# EAGLE schematic EEZ DIB MIO168 r1B1 (EAGLE 7.2.0)
Assembly variants: Farnell, TME

## Sheet 1 of 6: DIB interface
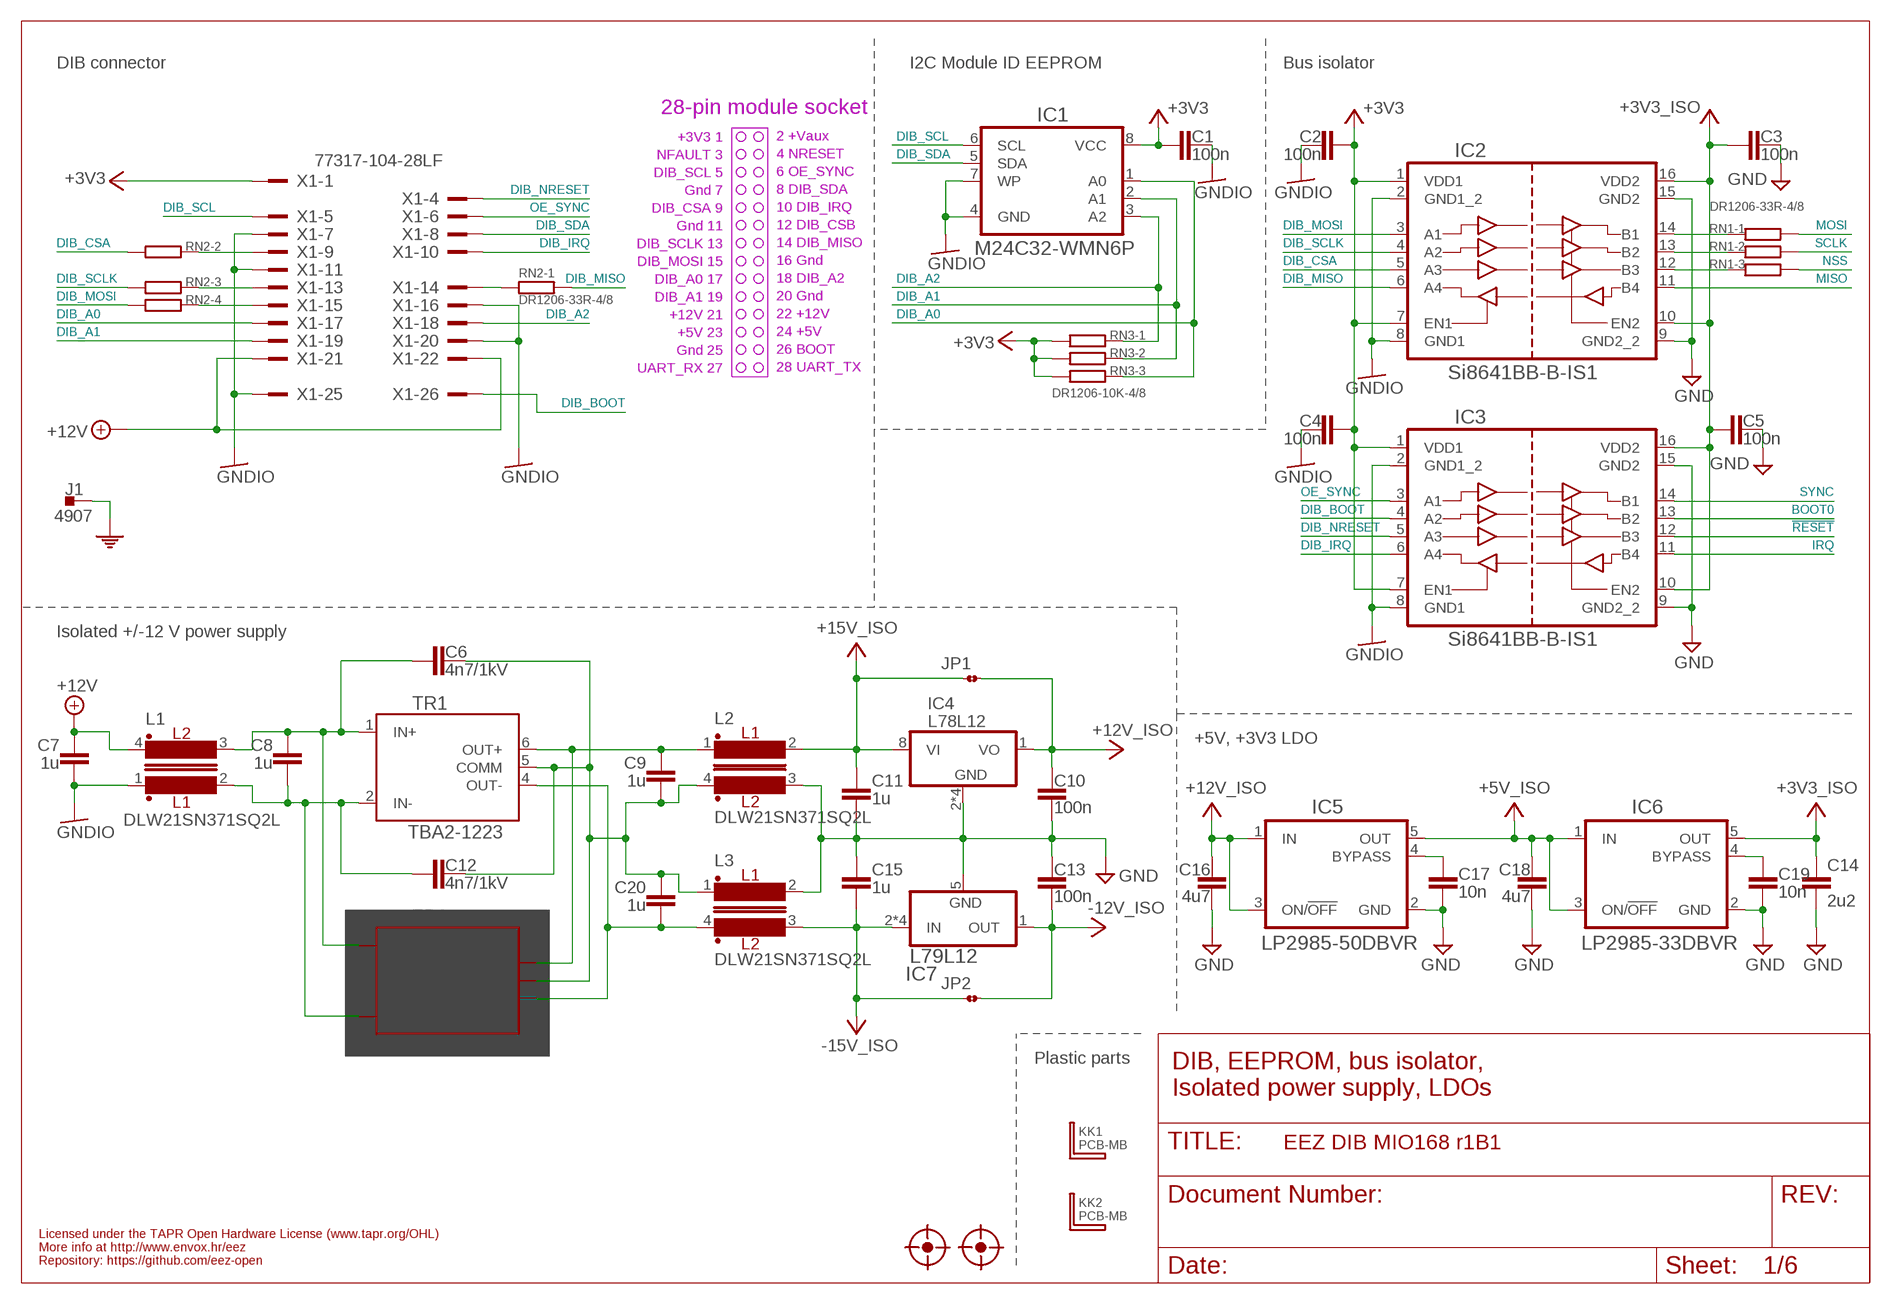
[diagram p0: schematic, sheet 1]

### Parts
C1  100n  C-EUC0603  [C0603]
C2  100n  C-EUC0603  [C0603]
C3  100n  C-EUC0603  [C0603]
C4  100n  C-EUC0603  [C0603]
C5  100n  C-EUC0603  [C0603]
C6  4n7/1kV  C-EUC1812  [C1812]
C7  1u  C-EUC0805  [C0805]
C8  1u  C-EUC0805  [C0805]
C9  1u  C-EUC0805  [C0805]
C10  100n  C-EUC0603  [C0603]
C11  1u  C-EUC0805  [C0805]
C12  4n7/1kV  C-EUC1812  [C1812]
C13  100n  C-EUC0603  [C0603]
C14  2u2  C-EUC0805  [C0805]
C15  1u  C-EUC0805  [C0805]
C16  4u7  C-EUC0805  [C0805]
C17  10n  C-EUC0805  [C0805]
C18  4u7  C-EUC0805  [C0805]
C19  10n  C-EUC0805  [C0805]
C20  1u  C-EUC0805  [C0805]
FM1  FIDUCIAL_2  [FIDUCIAL_DUAL]
FM2  FIDUCIAL_2  [FIDUCIAL_DUAL]
IC1  M24C32-WMN6P  AT24CXXSOIC8  [SOIC127P600X173-8N]
IC2  Si8641BB-B-IS1  SI8641NSOIC-16  [SOIC-16]
IC3  Si8641BB-B-IS1  SI8641NSOIC-16  [SOIC-16]
IC4  L78L12  MC78LXXSOIC8  [SOIC127P600X173-8N]
IC5  LP2985-50DBVR  LP2985  [SOT95P270X145-5N]
IC6  LP2985-33DBVR  LP2985  [SOT95P270X145-5N]
IC7  L79L12  MC79LXXSOIC  [SOIC127P600X173-8N]
J1  4907  PCB_TAB-4907  [PCB_TAB-4907]
JP1  JP2-CUT-0805  [R_0805]
JP2  JP2-CUT-0805  [R_0805]
KK1  PCB-MB  [PCB-MB]
KK2  PCB-MB  [PCB-MB]
L1  DLW21SN371SQ2L  DLW21S  [MURATA_DLW21S]
L2  DLW21SN371SQ2L  DLW21S  [MURATA_DLW21S]
L3  DLW21SN371SQ2L  DLW21S  [MURATA_DLW21S]
RN1  DR1206-33R-4/8  R_ARRAY4  [CAY16]
RN2  DR1206-33R-4/8  R_ARRAY4  [CAY16]
RN3  DR1206-10K-4/8  R_ARRAY4  [CAY16]
TR1  TBA2-1223  TBA-DUAL-2W  [TBA2]
TR2  MDD02M-15  MDD02  [MDD02]
X1  77317-104-28LF  [77317-104-28LF]

### Nets
!RESET: IC3.12(B3) ; also sheet 2,4,6
+3V3: C1.2 C2.1 C4.1 IC1.8(VCC) IC2.1(VDD1) IC2.7(EN1) IC3.1(VDD1) IC3.7(EN1) RN3.6 RN3.7 RN3.8 X1.1
+3V3_ISO: C3.2 C5.2 C14.1 IC2.10(EN2) IC2.16(VDD2) IC3.10(EN2) IC3.16(VDD2) IC6.5(OUT) ; also sheet 2,3,4,5,6
+5V_ISO: C18.2 IC5.5(OUT) IC6.1(IN) IC6.3(ON/!OFF) ; also sheet 4,6
+12V: C7.2 L1.4 X1.21 X1.22
+12V_ISO: C10.1 C16.2 IC4.1(VO) IC5.1(IN) IC5.3(ON/!OFF) JP1.2 ; also sheet 3,4
+15V_ISO: C11.2 IC4.8(VI) JP1.1 L2.2 ; also sheet 6
-12V_ISO: C13.2 IC7.1(OUT) JP2.2 ; also sheet 3,4,6
-15V_ISO: C15.1 IC7.2(IN) IC7.3(IN) IC7.6(IN) IC7.7(IN) JP2.1 L3.3 ; also sheet 6
BOOT0: IC3.13(B2) ; also sheet 2
DIB_A0: IC1.1(A0) RN3.3 X1.17
DIB_A1: IC1.2(A1) RN3.2 X1.19
DIB_A2: IC1.3(A2) RN3.1 X1.18
DIB_BOOT: IC3.4(A2) X1.26
DIB_CSA: IC2.5(A3) RN2.2
DIB_IRQ: IC3.6(A4) X1.10
DIB_MISO: IC2.6(A4) RN2.1
DIB_MOSI: IC2.3(A1) RN2.4
DIB_NRESET: IC3.5(A3) X1.4
DIB_SCL: IC1.6(SCL) X1.5
DIB_SCLK: IC2.4(A2) RN2.3
DIB_SDA: IC1.5(SDA) X1.8
GND: C3.1 C5.1 C10.2 C11.1 C13.1 C14.2 C15.2 C16.1 C17.1 C18.1 C19.1 IC2.9(GND2_2) IC2.15(GND2) IC3.9(GND2_2) IC3.15(GND2) IC4.2(GND) IC4.3(GND) IC4.6(GND) IC4.7(GND) IC5.2(GND) IC6.2(GND) IC7.5(GND) L2.3 L3.2 ; also sheet 2,3,4,5,6
GNDIO: C1.1 C2.2 C4.2 C7.1 IC1.4(GND) IC1.7(WP) IC2.2(GND1_2) IC2.8(GND1) IC3.2(GND1_2) IC3.8(GND1) L1.1 X1.7 X1.11 X1.16 X1.20 X1.25
IRQ: IC3.11(B4) ; also sheet 2
MISO: IC2.11(B4) ; also sheet 2
MOSI: RN1.8 ; also sheet 2
N$12: IC2.14(B1) RN1.1
N$47: C9.2 L2.1 TR1.6(OUT+) TR2.7(OUT+)
N$48: C6.2 C9.1 C12.2 C20.2 L2.4 L3.1 TR1.5(COMM) TR2.6(COMM)
N$49: C20.1 L3.4 TR1.4(OUT-) TR2.5(OUT-)
N$52: C6.1 C8.2 L1.3 TR1.1(IN+) TR2.1(IN+)
N$53: C8.1 C12.1 L1.2 TR1.2(IN-) TR2.2(IN-)
N$69: RN2.7 X1.9
N$70: C17.2 IC5.4(BYPASS)
N$99: RN2.6 X1.13
N$101: RN2.8 X1.14
N$102: RN2.5 X1.15
N$106: C19.2 IC6.4(BYPASS)
N$116: IC2.13(B2) RN1.2
N$118: IC2.12(B3) RN1.3
NSS: RN1.6 ; also sheet 2
OE_SYNC: IC3.3(A1) X1.6
PE: J1.1 J1.2 ; also sheet 6
SCLK: RN1.7 ; also sheet 2
SYNC: IC3.14(B1) ; also sheet 2
Unconnected: RN1.4 RN1.5 RN3.4 RN3.5 X1.2 X1.3 X1.12 X1.23 X1.24 X1.27 X1.28

### Notes on the sheet
- DIB connector | I2C Module ID EEPROM | Bus isolator
- 28-pin module socket
- +3V3 1
- 2 +Vaux
- NFAULT 3
- 4 NRESET
- DIB_SCL 5
- 6 OE_SYNC
- Gnd 7
- 8 DIB_SDA
- DIB_CSA 9
- 10 DIB_IRQ
- Gnd 11
- 12 DIB_CSB
- DIB_SCLK 13
- 14 DIB_MISO
- DIB_MOSI 15
- 16 Gnd
- DIB_A0 17
- 18 DIB_A2
- DIB_A1 19
- 20 Gnd
- +12V 21
- 22 +12V
- +5V 23
- 24 +5V
- Gnd 25
- 26 BOOT
- UART_RX 27
- 28 UART_TX
- Isolated +/-12 V power supply
- +5V, +3V3 LDO
- Plastic parts
- DIB, EEPROM, bus isolator,
  Isolated power supply, LDOs
- Licensed under the TAPR Open Hardware License (www.tapr.org/OHL)
- More info at http://www.envox.hr/eez
- Repository: https://github.com/eez-open

## Sheet 2 of 6
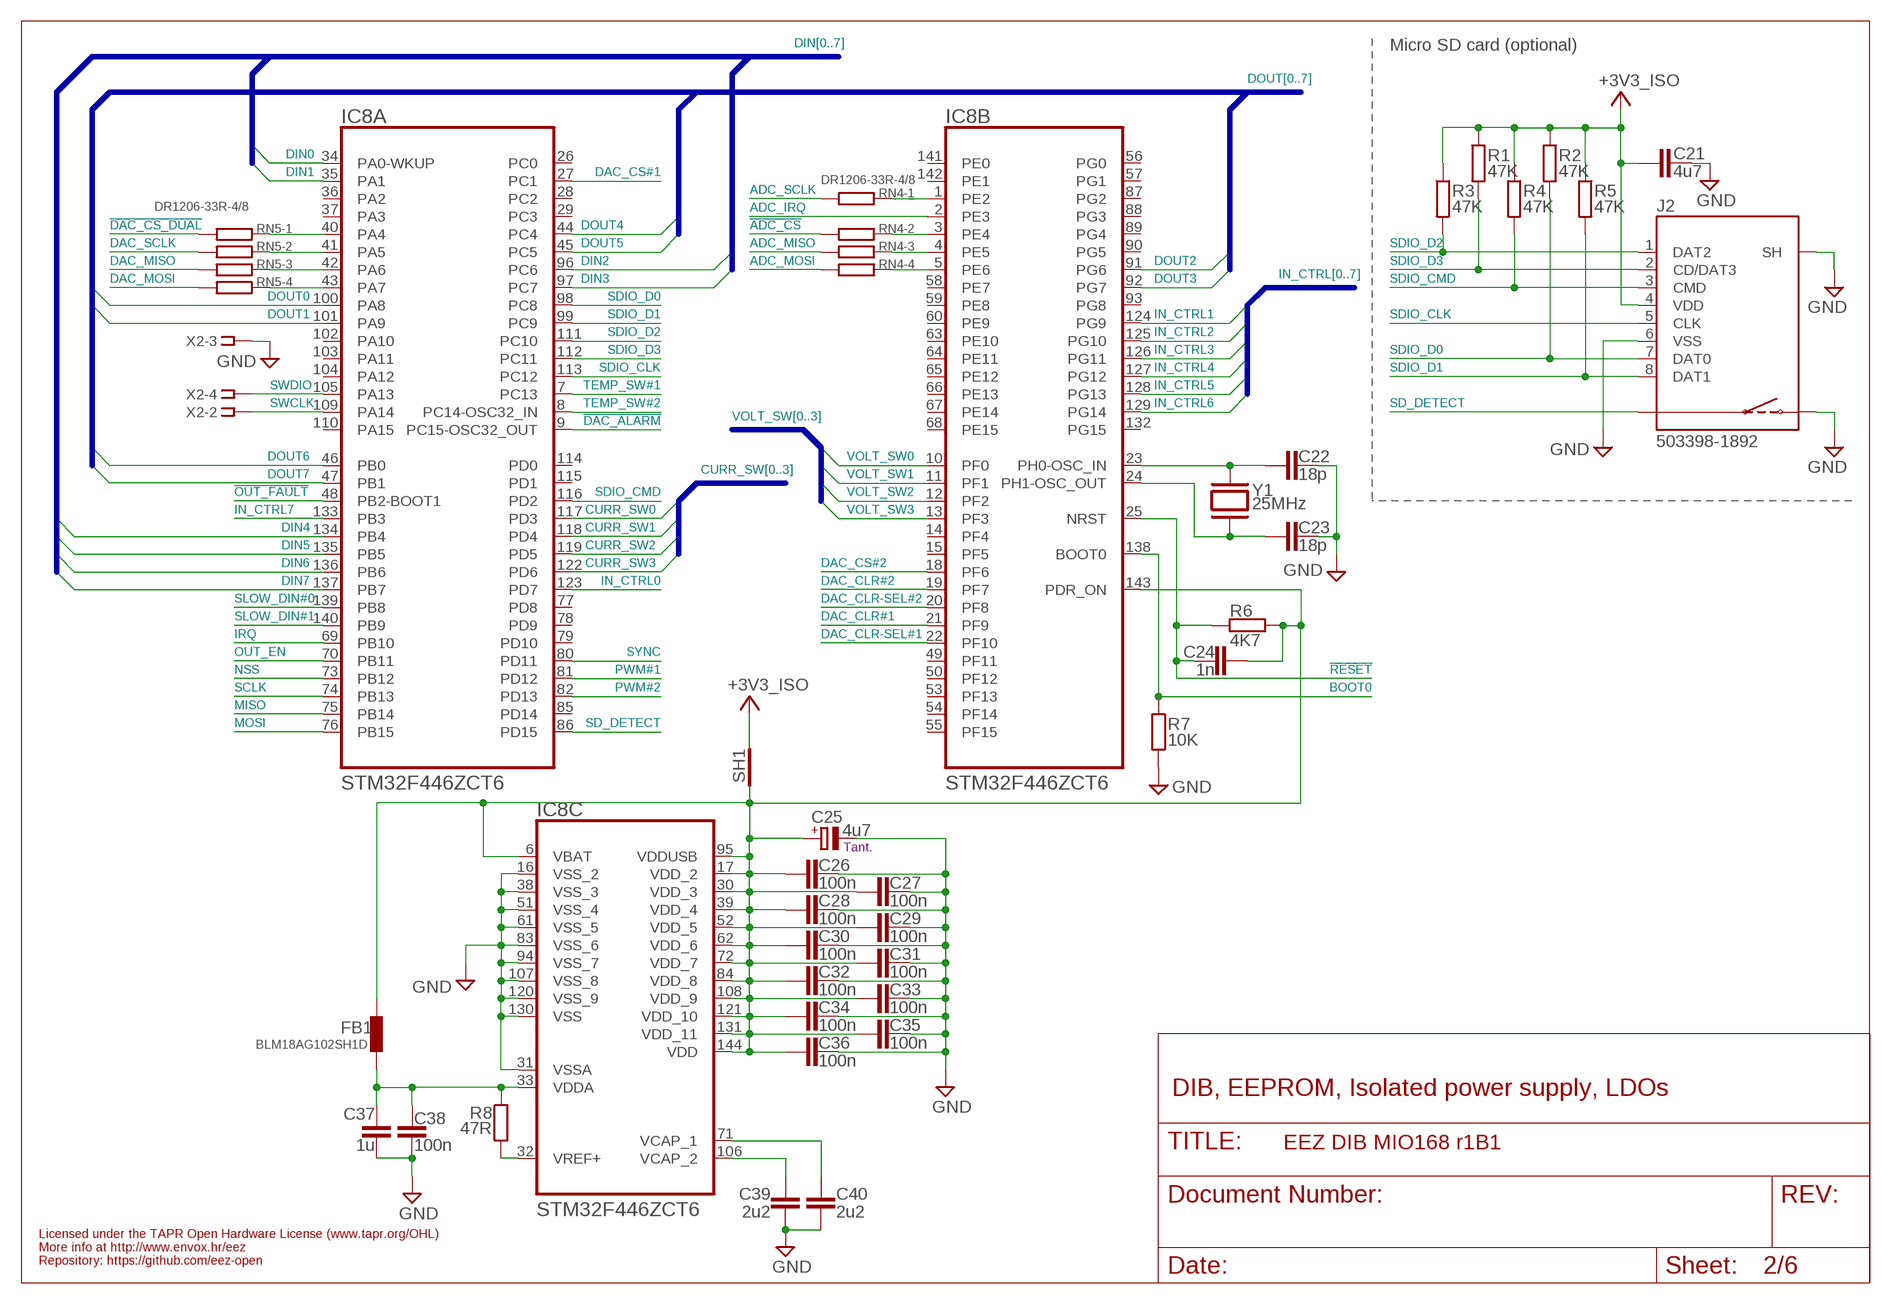
[diagram p1: schematic, sheet 2]

### Parts
C21  4u7  C-EUC0805  [C0805]
C22  18p  C-EUC0603  [C0603]
C23  18p  C-EUC0603  [C0603]
C24  1n  C-EUC0805  [C0805]
C25  4u7  ECAP1206  [EC1206]
C26  100n  C-EUC0603  [C0603]
C27  100n  C-EUC0603  [C0603]
C28  100n  C-EUC0603  [C0603]
C29  100n  C-EUC0603  [C0603]
C30  100n  C-EUC0603  [C0603]
C31  100n  C-EUC0603  [C0603]
C32  100n  C-EUC0603  [C0603]
C33  100n  C-EUC0603  [C0603]
C34  100n  C-EUC0603  [C0603]
C35  100n  C-EUC0603  [C0603]
C36  100n  C-EUC0603  [C0603]
C37  1u  C-EUC0805  [C0805]
C38  100n  C-EUC0603  [C0603]
C39  2u2  C-EUC0805  [C0805]
C40  2u2  C-EUC0805  [C0805]
FB1  BLM18AG102SH1D  FERRITE_BEAD0603  [BEAD0603]
IC8  STM32F446ZCT6  [LQFP-144]
J2  503398-1892  5033981892  [5033981892]
R1  47K  R-EU_R0805  [R0805]
R2  47K  R-EU_R0805  [R0805]
R3  47K  R-EU_R0805  [R0805]
R4  47K  R-EU_R0805  [R0805]
R5  47K  R-EU_R0805  [R0805]
R6  4K7  R-EU_R0805  [R0805]
R7  10K  R-EU_R0805  [R0805]
R8  47R  R-EU_R0805  [R0805]
RN4  DR1206-33R-4/8  R_ARRAY4  [CAY16]
RN5  DR1206-33R-4/8  R_ARRAY4  [CAY16]
SH1  SHORTNOHOLE  [SHORT_NOHOLE]
X2  SSW-106-02-S-S  [SSW-106-02-S-S]
Y1  25MHz  XTALSMD  [HC-49/4H]

### Nets
!ADC_CS: RN4.2 ; also sheet 6
!DAC_ALARM: IC8.9(A:PC15-OSC32_OUT) ; also sheet 3
!DAC_CS_DUAL: RN5.1 ; also sheet 4
!OUT_FAULT: IC8.48(A:PB2-BOOT1) ; also sheet 4
!RESET: C24.1 IC8.25(B:NRST) R6.2 ; also sheet 1,4,6
+3V3_ISO: C21.1 J2.4(VDD) R1.1 R2.1 R3.1 R4.1 R5.1 SH1.2(GND_B) ; also sheet 1,3,4,5,6
+3V3_MCU: C24.2 C25.+ C26.1 C27.1 C28.1 C29.1 C30.1 C31.1 C32.1 C33.1 C34.1 C35.1 C36.1 FB1.P$1 IC8.6(C:VBAT) IC8.17(C:VDD_2) IC8.30(C:VDD_3) IC8.39(C:VDD_4) IC8.52(C:VDD_5) IC8.62(C:VDD_6) IC8.72(C:VDD_7) IC8.84(C:VDD_8) IC8.95(C:VDDUSB) IC8.108(C:VDD_9) IC8.121(C:VDD_10) IC8.131(C:VDD_11) IC8.143(B:PDR_ON) IC8.144(C:VDD) R6.1 SH1.1(GND_A)
ADC_IRQ: IC8.2(B:PE3) ; also sheet 6
ADC_MISO: RN4.3 ; also sheet 6
ADC_MOSI: RN4.4 ; also sheet 6
ADC_SCLK: RN4.1 ; also sheet 6
BOOT0: IC8.138(B:BOOT0) R7.2 ; also sheet 1
CURR_SW0: IC8.117(A:PD3) ; also sheet 6
CURR_SW1: IC8.118(A:PD4) ; also sheet 6
CURR_SW2: IC8.119(A:PD5) ; also sheet 6
CURR_SW3: IC8.122(A:PD6) ; also sheet 6
DAC_CLR#1: IC8.21(B:PF9) ; also sheet 3
DAC_CLR#2: IC8.19(B:PF7) ; also sheet 3
DAC_CLR-SEL#1: IC8.22(B:PF10) ; also sheet 3
DAC_CLR-SEL#2: IC8.20(B:PF8) ; also sheet 3
DAC_CS#1: IC8.27(A:PC1) ; also sheet 3
DAC_CS#2: IC8.18(B:PF6) ; also sheet 3
DAC_MISO: RN5.3 ; also sheet 3
DAC_MOSI: RN5.4 ; also sheet 3,4
DAC_SCLK: RN5.2 ; also sheet 3,4
DIN0: IC8.34(A:PA0-WKUP) ; also sheet 5
DIN1: IC8.35(A:PA1) ; also sheet 5
DIN2: IC8.96(A:PC6) ; also sheet 5
DIN3: IC8.97(A:PC7) ; also sheet 5
DIN4: IC8.134(A:PB4) ; also sheet 5
DIN5: IC8.135(A:PB5) ; also sheet 5
DIN6: IC8.136(A:PB6) ; also sheet 5
DIN7: IC8.137(A:PB7) ; also sheet 5
DOUT0: IC8.100(A:PA8) ; also sheet 4
DOUT1: IC8.101(A:PA9) ; also sheet 4
DOUT2: IC8.91(B:PG6) ; also sheet 4
DOUT3: IC8.92(B:PG7) ; also sheet 4
DOUT4: IC8.44(A:PC4) ; also sheet 4
DOUT5: IC8.45(A:PC5) ; also sheet 4
DOUT6: IC8.46(A:PB0) ; also sheet 4
DOUT7: IC8.47(A:PB1) ; also sheet 4
GND: C21.2 C22.1 C23.1 C25.- C26.2 C27.2 C28.2 C29.2 C30.2 C31.2 C32.2 C33.2 C34.2 C35.2 C36.2 C37.2 C38.2 C39.1 C40.1 IC8.16(C:VSS_2) IC8.31(C:VSSA) IC8.38(C:VSS_3) IC8.51(C:VSS_4) IC8.61(C:VSS_5) IC8.83(C:VSS_6) IC8.94(C:VSS_7) IC8.107(C:VSS_8) IC8.120(C:VSS_9) IC8.130(C:VSS) J2.6(VSS) J2.S1(SH) J2.S2(SH) J2.S(SH) J2.SW2 R7.1 X2.3 ; also sheet 1,3,4,5,6
IN_CTRL0: IC8.123(A:PD7) ; also sheet 5
IN_CTRL1: IC8.124(B:PG9) ; also sheet 5
IN_CTRL2: IC8.125(B:PG10) ; also sheet 5
IN_CTRL3: IC8.126(B:PG11) ; also sheet 5
IN_CTRL4: IC8.127(B:PG12) ; also sheet 5
IN_CTRL5: IC8.128(B:PG13) ; also sheet 5
IN_CTRL6: IC8.129(B:PG14) ; also sheet 5
IN_CTRL7: IC8.133(A:PB3) ; also sheet 5
IRQ: IC8.69(A:PB10) ; also sheet 1
MISO: IC8.75(A:PB14) ; also sheet 1
MOSI: IC8.76(A:PB15) ; also sheet 1
N$11: IC8.40(A:PA4) RN5.8
N$29: IC8.41(A:PA5) RN5.7
N$34: IC8.42(A:PA6) RN5.6
N$37: IC8.43(A:PA7) RN5.5
N$39: IC8.1(B:PE2) RN4.8
N$40: IC8.3(B:PE4) RN4.7
N$41: IC8.4(B:PE5) RN4.6
N$44: IC8.5(B:PE6) RN4.5
N$97: C39.2 IC8.106(C:VCAP_2)
N$113: C40.2 IC8.71(C:VCAP_1)
N$115: C37.1 C38.1 FB1.P$2 IC8.33(C:VDDA) R8.1
N$121: IC8.32(C:VREF+) R8.2
NSS: IC8.73(A:PB12) ; also sheet 1
OUT_EN: IC8.70(A:PB11) ; also sheet 4
PWM#1: IC8.81(A:PD12) ; also sheet 4
PWM#2: IC8.82(A:PD13) ; also sheet 4
RCC_OSC_IN: C22.2 IC8.23(B:PH0-OSC_IN) Y1.2
RCC_OSC_OUT: C23.2 IC8.24(B:PH1-OSC_OUT) Y1.1
SCLK: IC8.74(A:PB13) ; also sheet 1
SD_DETECT: IC8.86(A:PD15) J2.SW1
SDIO_CLK: IC8.113(A:PC12) J2.5(CLK)
SDIO_CMD: IC8.116(A:PD2) J2.3(CMD) R4.2
SDIO_D0: IC8.98(A:PC8) J2.7(DAT0) R2.2
SDIO_D1: IC8.99(A:PC9) J2.8(DAT1) R5.2
SDIO_D2: IC8.111(A:PC10) J2.1(DAT2) R3.2
SDIO_D3: IC8.112(A:PC11) J2.2(CD/DAT3) R1.2
SLOW_DIN#0: IC8.139(A:PB8) ; also sheet 5
SLOW_DIN#1: IC8.140(A:PB9) ; also sheet 5
SWCLK: IC8.109(A:PA14) X2.2
SWDIO: IC8.105(A:PA13) X2.4
SYNC: IC8.80(A:PD11) ; also sheet 1
TEMP_SW#1: IC8.7(A:PC13) ; also sheet 6
TEMP_SW#2: IC8.8(A:PC14-OSC32_IN) ; also sheet 6
VOLT_SW0: IC8.10(B:PF0) ; also sheet 6
VOLT_SW1: IC8.11(B:PF1) ; also sheet 6
VOLT_SW2: IC8.12(B:PF2) ; also sheet 6
VOLT_SW3: IC8.13(B:PF3) ; also sheet 6
Unconnected: IC8.14(B:PF4) IC8.15(B:PF5) IC8.26(A:PC0) IC8.28(A:PC2) IC8.29(A:PC3) IC8.36(A:PA2) IC8.37(A:PA3) IC8.49(B:PF11) IC8.50(B:PF12) IC8.53(B:PF13) IC8.54(B:PF14) IC8.55(B:PF15) IC8.56(B:PG0) IC8.57(B:PG1) IC8.58(B:PE7) IC8.59(B:PE8) IC8.60(B:PE9) IC8.63(B:PE10) IC8.64(B:PE11) IC8.65(B:PE12) IC8.66(B:PE13) IC8.67(B:PE14) IC8.68(B:PE15) IC8.77(A:PD8) IC8.78(A:PD9) IC8.79(A:PD10) IC8.85(A:PD14) IC8.87(B:PG2) IC8.88(B:PG3) IC8.89(B:PG4) IC8.90(B:PG5) IC8.93(B:PG8) IC8.102(A:PA10) IC8.103(A:PA11) IC8.104(A:PA12) IC8.110(A:PA15) IC8.114(A:PD0) IC8.115(A:PD1) IC8.132(B:PG15) IC8.141(B:PE0) IC8.142(B:PE1) X2.1 X2.5 X2.6

### Buses
CURR_SW[0..3]
IN_CTRL[0..7]
DIN[0..7]
DOUT[0..7]
VOLT_SW[0..3]

### Notes on the sheet
- Micro SD card (optional)
- Tant.
- DIB, EEPROM, Isolated power supply, LDOs
- Licensed under the TAPR Open Hardware License (www.tapr.org/OHL)
- More info at http://www.envox.hr/eez
- Repository: https://github.com/eez-open

## Sheet 3 of 6: Voltage/current DACs
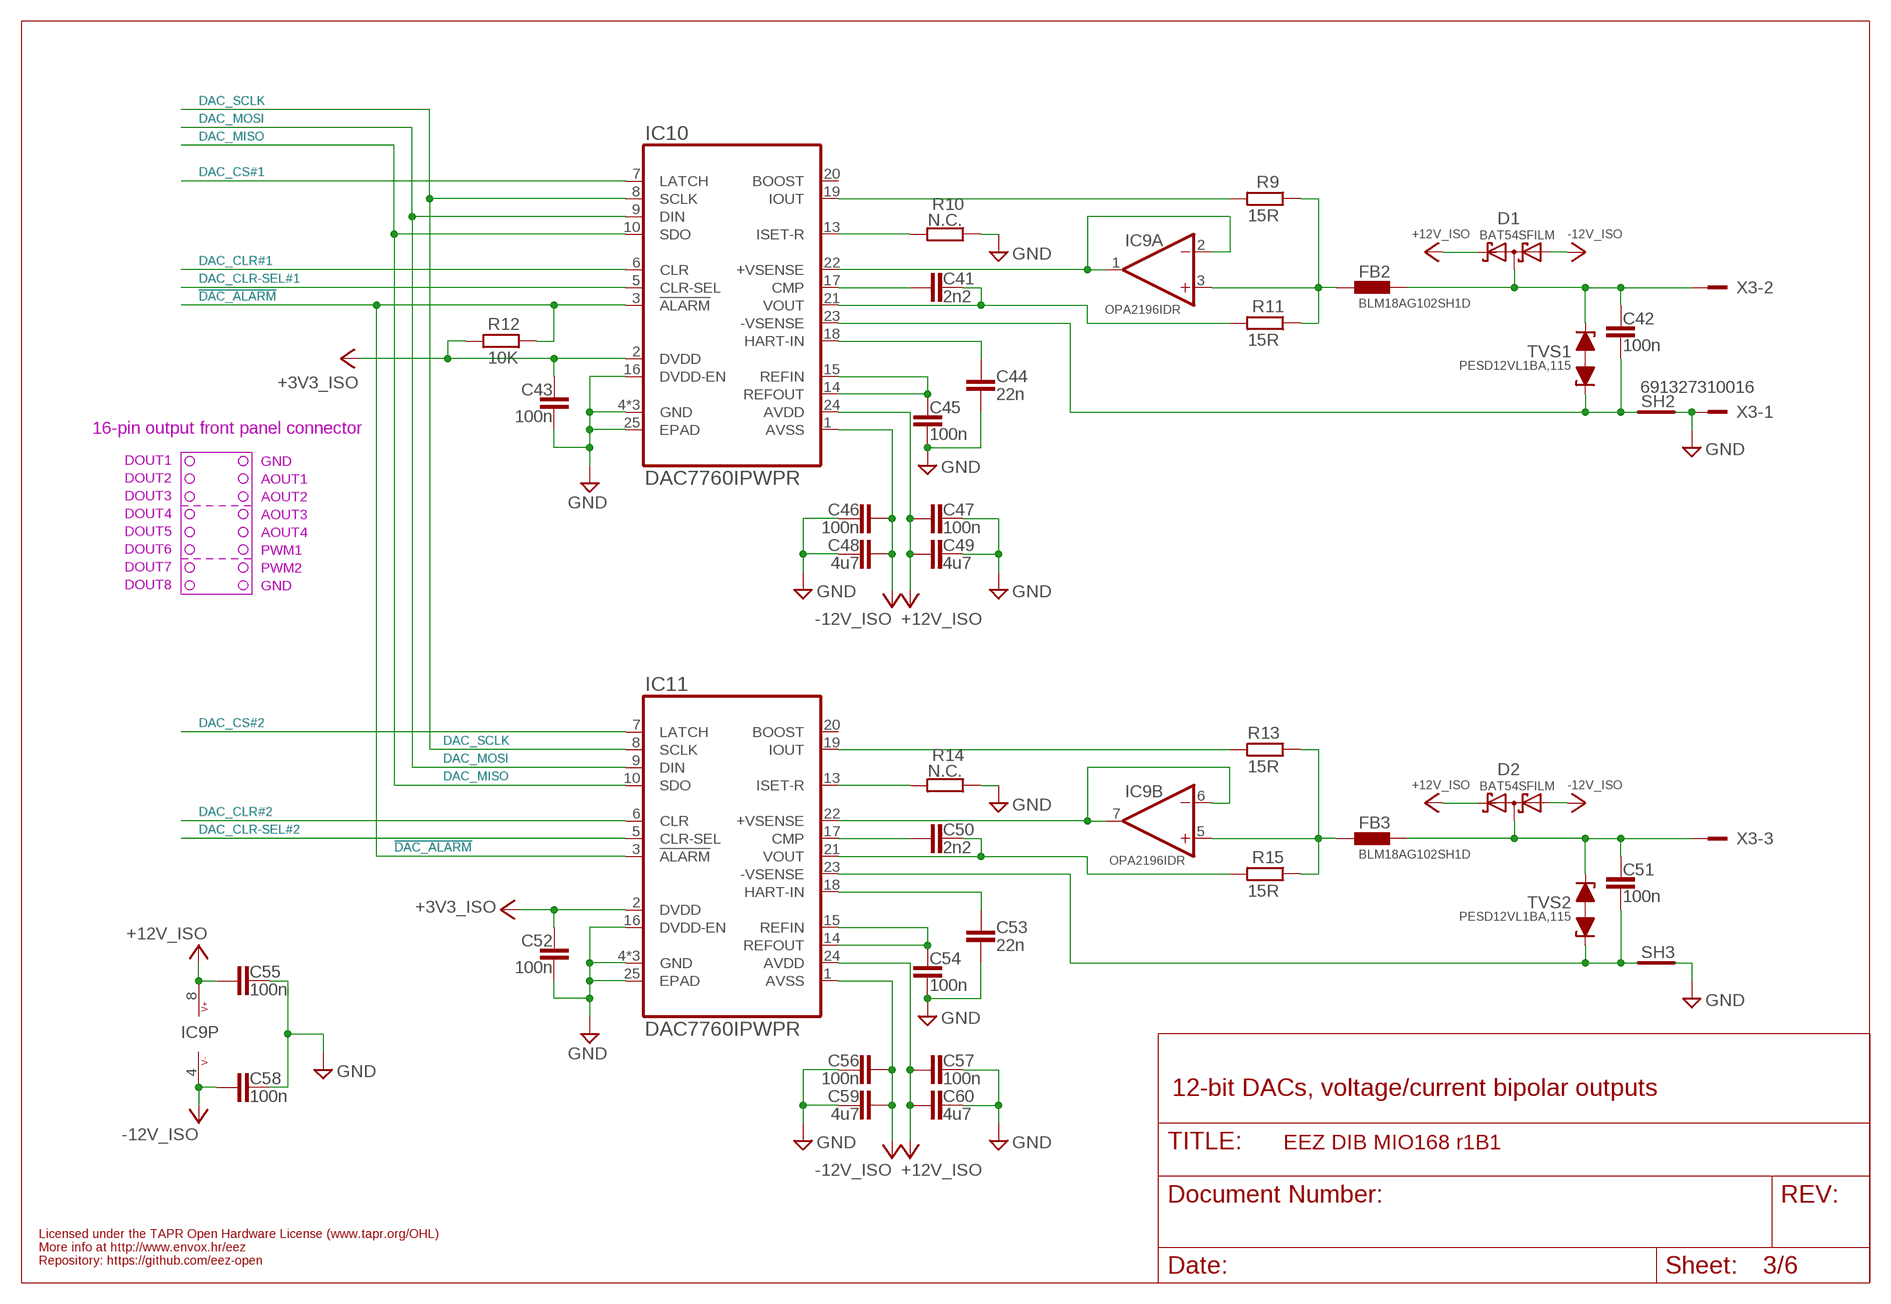
[diagram p2: schematic, sheet 3]

### Parts
C41  2n2  C-EUC0805  [C0805]
C42  100n  C-EUC0603  [C0603]
C43  100n  C-EUC0603  [C0603]
C44  22n  C-EUC0805  [C0805]
C45  100n  C-EUC0603  [C0603]
C46  100n  C-EUC0603  [C0603]
C47  100n  C-EUC0603  [C0603]
C48  4u7  C-EUC0805  [C0805]
C49  4u7  C-EUC0805  [C0805]
C50  2n2  C-EUC0805  [C0805]
C51  100n  C-EUC0603  [C0603]
C52  100n  C-EUC0603  [C0603]
C53  22n  C-EUC0805  [C0805]
C54  100n  C-EUC0603  [C0603]
C55  100n  C-EUC0603  [C0603]
C56  100n  C-EUC0603  [C0603]
C57  100n  C-EUC0603  [C0603]
C58  100n  C-EUC0603  [C0603]
C59  4u7  C-EUC0805  [C0805]
C60  4u7  C-EUC0805  [C0805]
D1  BAT54SFILM  BAT54S  [SOT23]
D2  BAT54SFILM  BAT54S  [SOT23]
FB2  BLM18AG102SH1D  FERRITE_BEAD0603  [BEAD0603]
FB3  BLM18AG102SH1D  FERRITE_BEAD0603  [BEAD0603]
IC9  OPA2196IDR  TL072SOIC8  [SOIC127P600X173-8N]
IC10  DAC7760IPWPR  [PWP24]
IC11  DAC7760IPWPR  [PWP24]
R9  15R  R-EU_R0805  [R0805]
R10  N.C.  R-EU_R0805  [R0805]
R11  15R  R-EU_R0805  [R0805]
R12  10K  R-EU_R0805  [R0805]
R13  15R  R-EU_R0805  [R0805]
R14  N.C.  R-EU_R0805  [R0805]
R15  15R  R-EU_R0805  [R0805]
SH2  SHORTNOHOLE  [SHORT_NOHOLE]
SH3  SHORTNOHOLE  [SHORT_NOHOLE]
TVS1  PESD12VL1BA,115  PESDXL1BA  [SOD323-BIDIR]
TVS2  PESD12VL1BA,115  PESDXL1BA  [SOD323-BIDIR]
X3  691327310016  [691327310016]

### Nets
!DAC_ALARM: IC10.3(!ALARM) IC11.3(!ALARM) R12.2 ; also sheet 2
+3V3_ISO: C43.1 C52.1 IC10.2(DVDD) IC11.2(DVDD) R12.1 ; also sheet 1,2,4,5,6
+12V_ISO: C47.1 C49.2 C55.1 C57.1 C60.2 D1.2(C2) D2.2(C2) IC9.8(P:V+) IC10.24(AVDD) IC11.24(AVDD) ; also sheet 1,4
-12V_ISO: C46.1 C48.2 C56.1 C58.1 C59.2 D1.1(A1) D2.1(A1) IC9.4(P:V-) IC10.1(AVSS) IC11.1(AVSS) ; also sheet 1,4,6
DAC_CLR#1: IC10.6(CLR) ; also sheet 2
DAC_CLR#2: IC11.6(CLR) ; also sheet 2
DAC_CLR-SEL#1: IC10.5(CLR-SEL) ; also sheet 2
DAC_CLR-SEL#2: IC11.5(CLR-SEL) ; also sheet 2
DAC_CS#1: IC10.7(LATCH) ; also sheet 2
DAC_CS#2: IC11.7(LATCH) ; also sheet 2
DAC_MISO: IC10.10(SDO) IC11.10(SDO) ; also sheet 2
DAC_MOSI: IC10.9(DIN) IC11.9(DIN) ; also sheet 2,4
DAC_OUT#1: C42.1 D1.3(C1A2) FB2.P$2 TVS1.C2 X3.2
DAC_OUT#2: C51.1 D2.3(C1A2) FB3.P$2 TVS2.C2 X3.3
DAC_SCLK: IC10.8(SCLK) IC11.8(SCLK) ; also sheet 2,4
GND: C43.2 C44.1 C45.2 C46.2 C47.2 C48.1 C49.1 C52.2 C53.1 C54.2 C55.2 C56.2 C57.2 C58.2 C59.1 C60.1 IC10.4(GND) IC10.11(GND) IC10.12(GND) IC10.16(DVDD-EN) IC10.25(EPAD) IC11.4(GND) IC11.11(GND) IC11.12(GND) IC11.16(DVDD-EN) IC11.25(EPAD) R10.1 R14.1 SH2.1(GND_A) SH3.1(GND_A) X3.1 ; also sheet 1,2,4,5,6
HART#1: C44.2 IC10.18(HART-IN)
HART#2: C53.2 IC11.18(HART-IN)
N$19: C50.2 IC11.17(CMP)
N$26: C50.1 IC11.21(VOUT) R15.2
N$27: IC9.6(B:-IN) IC9.7(B:OUT) IC11.22(+VSENSE)
N$43: FB3.P$1 IC9.5(B:+IN) R13.1 R15.1
N$45: IC11.19(IOUT) R13.2
N$46: C54.1 IC11.14(REFOUT) IC11.15(REFIN)
N$62: C41.2 IC10.17(CMP)
N$63: IC9.1(A:OUT) IC9.2(A:-IN) IC10.22(+VSENSE)
N$64: C51.2 IC11.23(-VSENSE) SH3.2(GND_B) TVS2.C1
N$65: FB2.P$1 IC9.3(A:+IN) R9.1 R11.1
N$66: C45.1 IC10.14(REFOUT) IC10.15(REFIN)
N$68: IC11.13(ISET-R) R14.2
N$79: C42.2 IC10.23(-VSENSE) SH2.2(GND_B) TVS1.C1
N$80: IC10.13(ISET-R) R10.2
N$82: C41.1 IC10.21(VOUT) R11.2
N$83: IC10.19(IOUT) R9.2
Unconnected: IC10.20(BOOST) IC11.20(BOOST)

### Notes on the sheet
- 16-pin output front panel connector
- GND
- DOUT1
- AOUT1
- DOUT2
- AOUT2
- DOUT3
- AOUT3
- DOUT4
- AOUT4
- DOUT5
- PWM1
- DOUT6
- PWM2
- DOUT7
- GND
- DOUT8
- 12-bit DACs, voltage/current bipolar outputs
- Licensed under the TAPR Open Hardware License (www.tapr.org/OHL)
- More info at http://www.envox.hr/eez
- Repository: https://github.com/eez-open

## Sheet 4 of 6: Voltage DAC, Digital outputs
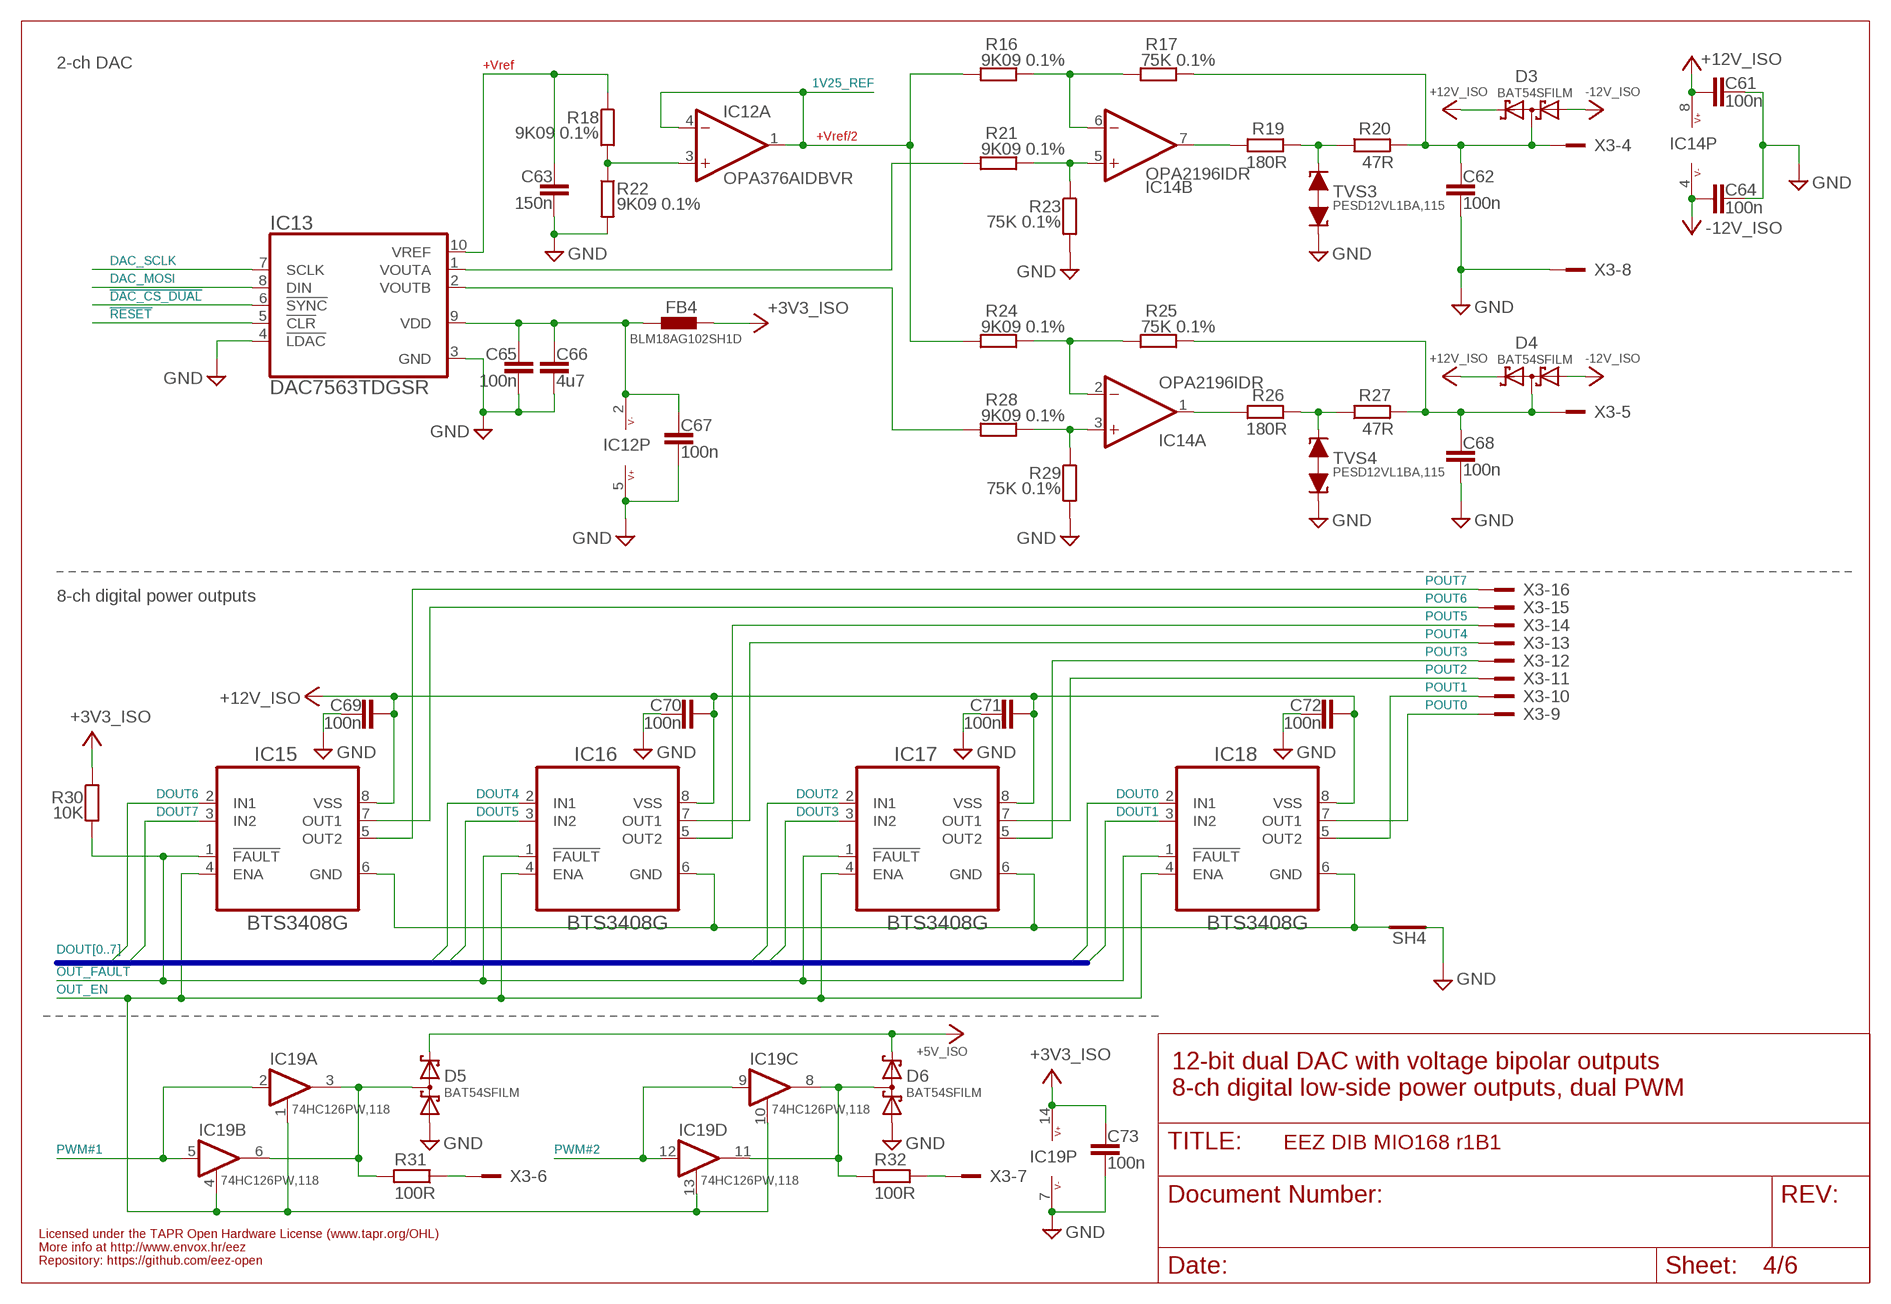
[diagram p3: schematic, sheet 4]

### Parts
C61  100n  C-EUC0603  [C0603]
C62  100n  C-EUC0603  [C0603]
C63  150n  C-EUC0805  [C0805]
C64  100n  C-EUC0603  [C0603]
C65  100n  C-EUC0603  [C0603]
C66  4u7  C-EUC0805  [C0805]
C67  100n  C-EUC0603  [C0603]
C68  100n  C-EUC0603  [C0603]
C69  100n  C-EUC0603  [C0603]
C70  100n  C-EUC0603  [C0603]
C71  100n  C-EUC0603  [C0603]
C72  100n  C-EUC0603  [C0603]
C73  100n  C-EUC0603  [C0603]
D3  BAT54SFILM  BAT54S  [SOT23]
D4  BAT54SFILM  BAT54S  [SOT23]
D5  BAT54SFILM  BAT54S  [SOT23]
D6  BAT54SFILM  BAT54S  [SOT23]
FB4  BLM18AG102SH1D  FERRITE_BEAD0603  [BEAD0603]
IC12  OPA376AIDBVR  [DBV5]
IC13  DAC7563TDGSR  [DGS10]
IC14  OPA2196IDR  TL072SOIC8  [SOIC127P600X173-8N]
IC15  BTS3408G  [SOIC127P600X173-8N]
IC16  BTS3408G  [SOIC127P600X173-8N]
IC17  BTS3408G  [SOIC127P600X173-8N]
IC18  BTS3408G  [SOIC127P600X173-8N]
IC19  74HC126PW,118  [PW14]
R16  9K09 0.1%  R-EU_R0805  [R0805]
R17  75K 0.1%  R-EU_R0805  [R0805]
R18  9K09 0.1%  R-EU_R0805  [R0805]
R19  180R  R-EU_R0805  [R0805]
R20  47R  R-EU_R0805  [R0805]
R21  9K09 0.1%  R-EU_R0805  [R0805]
R22  9K09 0.1%  R-EU_R0805  [R0805]
R23  75K 0.1%  R-EU_R0805  [R0805]
R24  9K09 0.1%  R-EU_R0805  [R0805]
R25  75K 0.1%  R-EU_R0805  [R0805]
R26  180R  R-EU_R0805  [R0805]
R27  47R  R-EU_R0805  [R0805]
R28  9K09 0.1%  R-EU_R0805  [R0805]
R29  75K 0.1%  R-EU_R0805  [R0805]
R30  10K  R-EU_R0805  [R0805]
R31  100R  R-EU_R0805  [R0805]
R32  100R  R-EU_R0805  [R0805]
SH4  SHORTNOHOLE  [SHORT_NOHOLE]
TVS3  PESD12VL1BA,115  PESDXL1BA  [SOD323-BIDIR]
TVS4  PESD12VL1BA,115  PESDXL1BA  [SOD323-BIDIR]

### Nets
1V25_REF: IC12.1(A:OUT) IC12.4(A:-IN) R16.2 R24.2 ; also sheet 6
2V5_REF: C63.2 IC13.10(VREF) R18.1
!DAC_CS_DUAL: IC13.6(!SYNC) ; also sheet 2
!OUT_FAULT: IC15.1(!FAULT) IC16.1(!FAULT) IC17.1(!FAULT) IC18.1(!FAULT) R30.2 ; also sheet 2
!RESET: IC13.5(!CLR) ; also sheet 1,2,6
+3V3_ISO: C73.2 FB4.P$2 IC19.14(P:V+) R30.1 ; also sheet 1,2,3,5,6
+5V_ISO: D5.2(C2) D6.2(C2) ; also sheet 1,6
+12V_ISO: C61.1 C69.2 C70.2 C71.2 C72.2 D3.2(C2) D4.2(C2) IC14.8(P:V+) IC15.8(VSS) IC16.8(VSS) IC17.8(VSS) IC18.8(VSS) ; also sheet 1,3
-12V_ISO: C64.1 D3.1(A1) D4.1(A1) IC14.4(P:V-) ; also sheet 1,3,6
DAC_MOSI: IC13.8(DIN) ; also sheet 2,3
DAC_SCLK: IC13.7(SCLK) ; also sheet 2,3
DOUT0: IC18.2(IN1) ; also sheet 2
DOUT1: IC18.3(IN2) ; also sheet 2
DOUT2: IC17.2(IN1) ; also sheet 2
DOUT3: IC17.3(IN2) ; also sheet 2
DOUT4: IC16.2(IN1) ; also sheet 2
DOUT5: IC16.3(IN2) ; also sheet 2
DOUT6: IC15.2(IN1) ; also sheet 2
DOUT7: IC15.3(IN2) ; also sheet 2
GND: C61.2 C62.2 C63.1 C64.2 C65.2 C66.1 C67.2 C68.2 C69.1 C70.1 C71.1 C72.1 C73.1 D5.1(A1) D6.1(A1) IC12.5(P:V+) IC13.3(GND) IC13.4(!LDAC) IC19.7(P:V-) R22.2 R23.2 R29.2 SH4.1(GND_A) TVS3.C1 TVS4.C1 X3.8 ; also sheet 1,2,3,5,6
ISET1: R19.2 R20.1 TVS3.C2
ISET2: R26.2 R27.1 TVS4.C2
N$1: IC15.6(GND) IC16.6(GND) IC17.6(GND) IC18.6(GND) SH4.2(GND_B)
N$22: R31.1 X3.6
N$25: R32.1 X3.7
N$54: IC14.5(B:+IN) R21.1 R23.1
N$55: IC14.6(B:-IN) R16.1 R17.2
N$56: IC14.7(B:OUT) R19.1
N$57: IC14.3(A:+IN) R28.1 R29.1
N$58: IC14.2(A:-IN) R24.1 R25.2
N$59: IC14.1(A:OUT) R26.1
N$60: IC12.3(A:+IN) R18.2 R22.1
N$61: IC13.1(VOUTA) R21.2
N$67: IC13.2(VOUTB) R28.2
N$71: C65.1 C66.2 C67.1 FB4.P$1 IC12.2(P:V-) IC13.9(VDD)
N$73: C68.1 D4.3(C1A2) R25.1 R27.2 X3.5
N$74: C62.1 D3.3(C1A2) R17.1 R20.2 X3.4
N$129: D5.3(C1A2) IC19.3(A:O) IC19.6(B:O) R31.2
N$134: D6.3(C1A2) IC19.8(C:O) IC19.11(D:O) R32.2
OUT_EN: IC15.4(ENA) IC16.4(ENA) IC17.4(ENA) IC18.4(ENA) IC19.1(A:EN) IC19.4(B:EN) IC19.10(C:EN) IC19.13(D:EN) ; also sheet 2
POUT0: IC18.7(OUT1) X3.9
POUT1: IC18.5(OUT2) X3.10
POUT2: IC17.7(OUT1) X3.11
POUT3: IC17.5(OUT2) X3.12
POUT4: IC16.7(OUT1) X3.13
POUT5: IC16.5(OUT2) X3.14
POUT6: IC15.7(OUT1) X3.15
POUT7: IC15.5(OUT2) X3.16
PWM#1: IC19.2(A:I) IC19.5(B:I) ; also sheet 2
PWM#2: IC19.9(C:I) IC19.12(D:I) ; also sheet 2

### Buses
DOUT[0..7]

### Notes on the sheet
- 2-ch DAC
- +Vref
- +Vref/2
- 8-ch digital power outputs
- 12-bit dual DAC with voltage bipolar outputs
  8-ch digital low-side power outputs, dual PWM
- Licensed under the TAPR Open Hardware License (www.tapr.org/OHL)
- More info at http://www.envox.hr/eez
- Repository: https://github.com/eez-open

## Sheet 5 of 6: Digital inputs
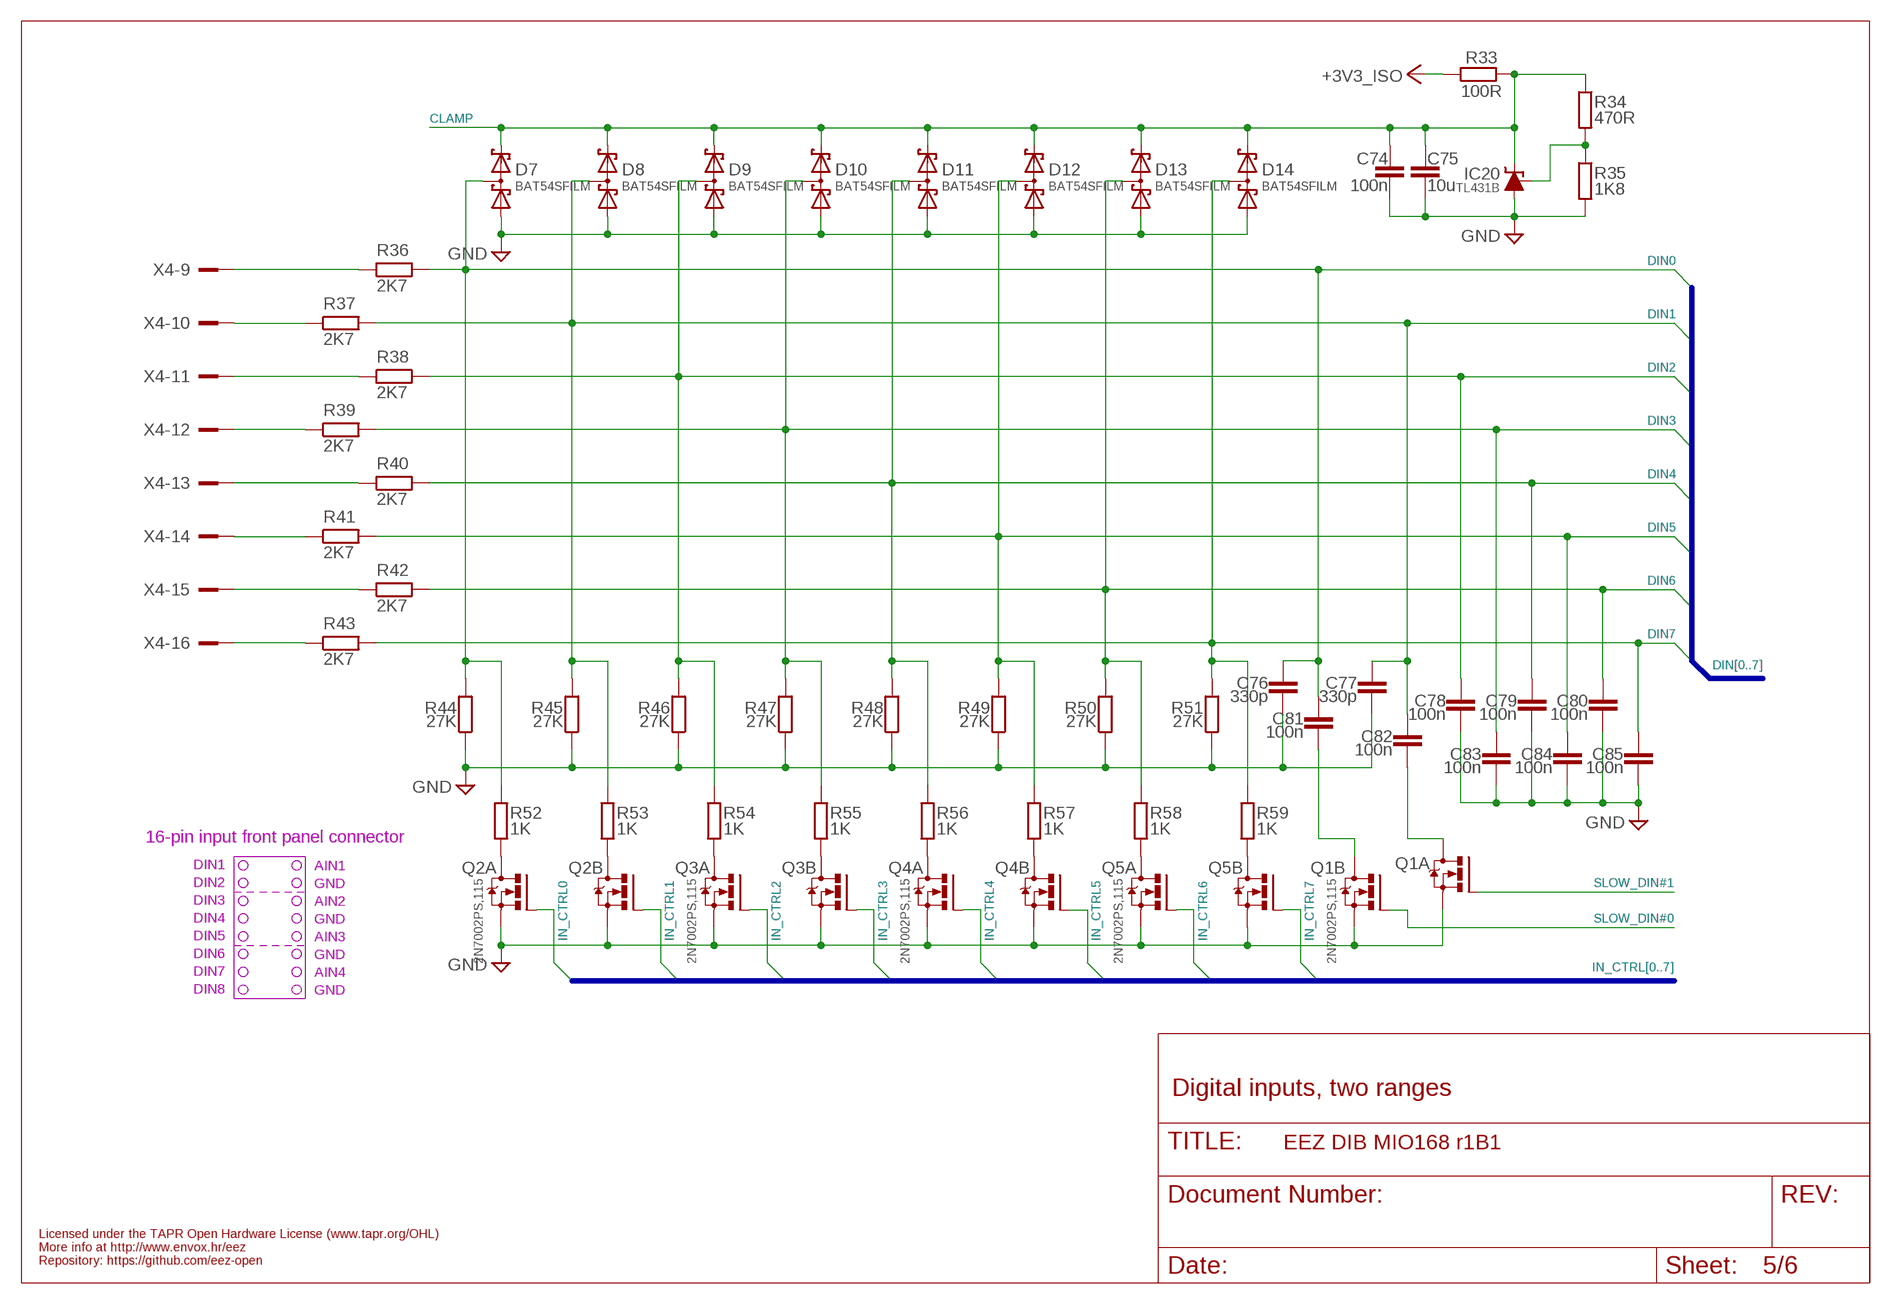
[diagram p4: schematic, sheet 5]

### Parts
C74  100n  C-EUC0603  [C0603]
C75  10u  C-EUC1206  [C1206]
C76  330p  C-EUC0805  [C0805]
C77  330p  C-EUC0805  [C0805]
C78  100n  C-EUC0603  [C0603]
C79  100n  C-EUC0603  [C0603]
C80  100n  C-EUC0603  [C0603]
C81  100n  C-EUC0603  [C0603]
C82  100n  C-EUC0603  [C0603]
C83  100n  C-EUC0603  [C0603]
C84  100n  C-EUC0603  [C0603]
C85  100n  C-EUC0603  [C0603]
D7  BAT54SFILM  BAT54S  [SOT23]
D8  BAT54SFILM  BAT54S  [SOT23]
D9  BAT54SFILM  BAT54S  [SOT23]
D10  BAT54SFILM  BAT54S  [SOT23]
D11  BAT54SFILM  BAT54S  [SOT23]
D12  BAT54SFILM  BAT54S  [SOT23]
D13  BAT54SFILM  BAT54S  [SOT23]
D14  BAT54SFILM  BAT54S  [SOT23]
IC20  TL431B  TL431  [SOT103P240X110-3N]
Q1  2N7002PS,115  [SC88]
Q2  2N7002PS,115  [SC88]
Q3  2N7002PS,115  [SC88]
Q4  2N7002PS,115  [SC88]
Q5  2N7002PS,115  [SC88]
R33  100R  R-EU_R0805  [R0805]
R34  470R  R-EU_R0805  [R0805]
R35  1K8  R-EU_R0805  [R0805]
R36  2K7  R-EU_R1206  [R1206]
R37  2K7  R-EU_R1206  [R1206]
R38  2K7  R-EU_R1206  [R1206]
R39  2K7  R-EU_R1206  [R1206]
R40  2K7  R-EU_R1206  [R1206]
R41  2K7  R-EU_R1206  [R1206]
R42  2K7  R-EU_R1206  [R1206]
R43  2K7  R-EU_R1206  [R1206]
R44  27K  R-EU_R0805  [R0805]
R45  27K  R-EU_R0805  [R0805]
R46  27K  R-EU_R0805  [R0805]
R47  27K  R-EU_R0805  [R0805]
R48  27K  R-EU_R0805  [R0805]
R49  27K  R-EU_R0805  [R0805]
R50  27K  R-EU_R0805  [R0805]
R51  27K  R-EU_R0805  [R0805]
R52  1K  R-EU_R0805  [R0805]
R53  1K  R-EU_R0805  [R0805]
R54  1K  R-EU_R0805  [R0805]
R55  1K  R-EU_R0805  [R0805]
R56  1K  R-EU_R0805  [R0805]
R57  1K  R-EU_R0805  [R0805]
R58  1K  R-EU_R0805  [R0805]
R59  1K  R-EU_R0805  [R0805]
X4  691327310016  [691327310016]

### Nets
+3V3_ISO: R33.1 ; also sheet 1,2,3,4,6
CLAMP: C74.1 C75.1 D7.2(C2) D8.2(C2) D9.2(C2) D10.2(C2) D11.2(C2) D12.2(C2) D13.2(C2) D14.2(C2) IC20.1(C) R33.2 R34.1
DIN0: C76.1 C81.1 D7.3(C1A2) R36.2 R44.2 R52.1 ; also sheet 2
DIN1: C77.1 C82.1 D8.3(C1A2) R37.2 R45.2 R53.1 ; also sheet 2
DIN2: C78.1 D9.3(C1A2) R38.2 R46.2 R54.1 ; also sheet 2
DIN3: C83.1 D10.3(C1A2) R39.2 R47.2 R55.1 ; also sheet 2
DIN4: C79.1 D11.3(C1A2) R40.2 R48.2 R56.1 ; also sheet 2
DIN5: C84.1 D12.3(C1A2) R41.2 R49.2 R57.1 ; also sheet 2
DIN6: C80.1 D13.3(C1A2) R42.2 R50.2 R58.1 ; also sheet 2
DIN7: C85.1 D14.3(C1A2) R43.2 R51.2 R59.1 ; also sheet 2
GND: C74.2 C75.2 C76.2 C77.2 C78.2 C79.2 C80.2 C83.2 C84.2 C85.2 D7.1(A1) D8.1(A1) D9.1(A1) D10.1(A1) D11.1(A1) D12.1(A1) D13.1(A1) D14.1(A1) IC20.3(A) Q1.1(A:S) Q1.4(B:S) Q2.1(A:S) Q2.4(B:S) Q3.1(A:S) Q3.4(B:S) Q4.1(A:S) Q4.4(B:S) Q5.1(A:S) Q5.4(B:S) R35.2 R44.1 R45.1 R46.1 R47.1 R48.1 R49.1 R50.1 R51.1 ; also sheet 1,2,3,4,6
IN_CTRL0: Q2.2(A:G) ; also sheet 2
IN_CTRL1: Q2.5(B:G) ; also sheet 2
IN_CTRL2: Q3.2(A:G) ; also sheet 2
IN_CTRL3: Q3.5(B:G) ; also sheet 2
IN_CTRL4: Q4.2(A:G) ; also sheet 2
IN_CTRL5: Q4.5(B:G) ; also sheet 2
IN_CTRL6: Q5.2(A:G) ; also sheet 2
IN_CTRL7: Q5.5(B:G) ; also sheet 2
N$7: IC20.2(R) R34.2 R35.1
N$8: Q2.6(A:D) R52.2
N$9: Q2.3(B:D) R53.2
N$10: Q3.6(A:D) R54.2
N$13: Q3.3(B:D) R55.2
N$14: R37.1 X4.10
N$15: Q4.6(A:D) R56.2
N$16: Q4.3(B:D) R57.2
N$17: Q5.6(A:D) R58.2
N$23: Q5.3(B:D) R59.2
N$24: C81.2 Q1.3(B:D)
N$36: R36.1 X4.9
N$38: R38.1 X4.11
N$42: R39.1 X4.12
N$76: C82.2 Q1.6(A:D)
N$109: R40.1 X4.13
N$119: R42.1 X4.15
N$120: R43.1 X4.16
N$122: R41.1 X4.14
SLOW_DIN#0: Q1.5(B:G) ; also sheet 2
SLOW_DIN#1: Q1.2(A:G) ; also sheet 2

### Buses
DIN[0..7]
IN_CTRL[0..7]

### Notes on the sheet
- 16-pin input front panel connector
- AIN1
- DIN1
- GND
- DIN2
- AIN2
- DIN3
- GND
- DIN4
- AIN3
- DIN5
- GND
- DIN6
- AIN4
- DIN7
- GND
- DIN8
- Digital inputs, two ranges
- Licensed under the TAPR Open Hardware License (www.tapr.org/OHL)
- More info at http://www.envox.hr/eez
- Repository: https://github.com/eez-open

## Sheet 6 of 6: Voltage/current ADC
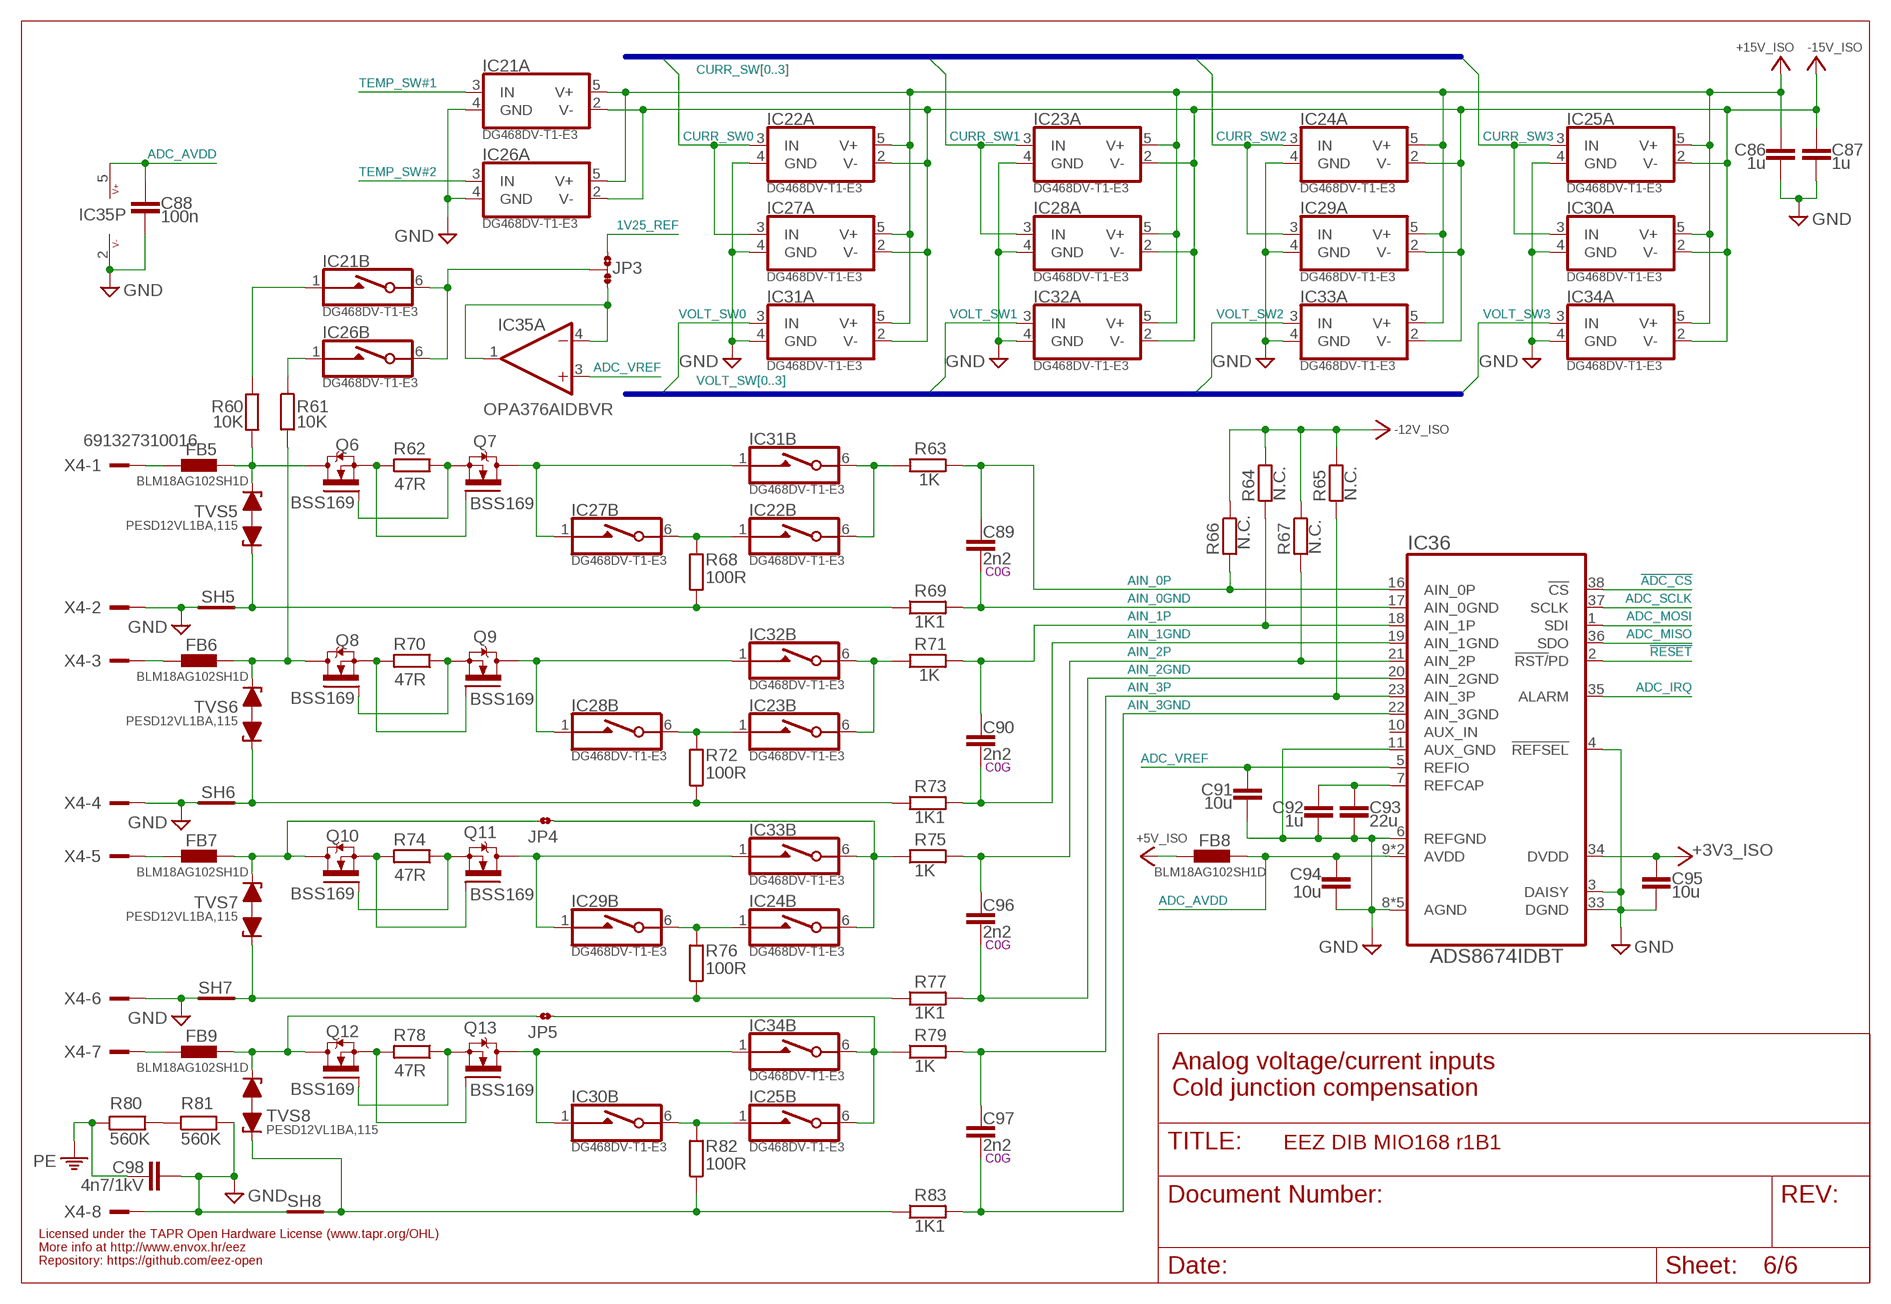
[diagram p5: schematic, sheet 6]

### Parts
C86  1u  C-EUC0805  [C0805]
C87  1u  C-EUC0805  [C0805]
C88  100n  C-EUC0603  [C0603]
C89  2n2  C-EUC0805  [C0805]
C90  2n2  C-EUC0805  [C0805]
C91  10u  C-EUC1206  [C1206]
C92  1u  C-EUC0805  [C0805]
C93  22u  C-EUC1206  [C1206]
C94  10u  C-EUC1206  [C1206]
C95  10u  C-EUC1206  [C1206]
C96  2n2  C-EUC0805  [C0805]
C97  2n2  C-EUC0805  [C0805]
C98  4n7/1kV  C-EUC1812  [C1812]
FB5  BLM18AG102SH1D  FERRITE_BEAD0603  [BEAD0603]
FB6  BLM18AG102SH1D  FERRITE_BEAD0603  [BEAD0603]
FB7  BLM18AG102SH1D  FERRITE_BEAD0603  [BEAD0603]
FB8  BLM18AG102SH1D  FERRITE_BEAD0603  [BEAD0603]
FB9  BLM18AG102SH1D  FERRITE_BEAD0603  [BEAD0603]
IC21  DG468DV-T1-E3  [DG6_TSOP6]
IC22  DG468DV-T1-E3  [DG6_TSOP6]
IC23  DG468DV-T1-E3  [DG6_TSOP6]
IC24  DG468DV-T1-E3  [DG6_TSOP6]
IC25  DG468DV-T1-E3  [DG6_TSOP6]
IC26  DG468DV-T1-E3  [DG6_TSOP6]
IC27  DG468DV-T1-E3  [DG6_TSOP6]
IC28  DG468DV-T1-E3  [DG6_TSOP6]
IC29  DG468DV-T1-E3  [DG6_TSOP6]
IC30  DG468DV-T1-E3  [DG6_TSOP6]
IC31  DG468DV-T1-E3  [DG6_TSOP6]
IC32  DG468DV-T1-E3  [DG6_TSOP6]
IC33  DG468DV-T1-E3  [DG6_TSOP6]
IC34  DG468DV-T1-E3  [DG6_TSOP6]
IC35  OPA376AIDBVR  [DBV5]
IC36  ADS8674IDBT  [DBT38]
JP3  JP3-CUT  [JP3-CUT]
JP4  JP2-CUT-0805  [R_0805]
JP5  JP2-CUT-0805  [R_0805]
Q6  BSS169  [SOT103P240X110-3N]
Q7  BSS169  [SOT103P240X110-3N]
Q8  BSS169  [SOT103P240X110-3N]
Q9  BSS169  [SOT103P240X110-3N]
Q10  BSS169  [SOT103P240X110-3N]
Q11  BSS169  [SOT103P240X110-3N]
Q12  BSS169  [SOT103P240X110-3N]
Q13  BSS169  [SOT103P240X110-3N]
R60  10K  R-EU_R0805  [R0805]
R61  10K  R-EU_R0805  [R0805]
R62  47R  R-EU_R0805  [R0805]
R63  1K  R-EU_R0805  [R0805]
R64  N.C.  R-EU_R0805  [R0805]
R65  N.C.  R-EU_R0805  [R0805]
R66  N.C.  R-EU_R0805  [R0805]
R67  N.C.  R-EU_R0805  [R0805]
R68  100R  R-EU_R0805  [R0805]
R69  1K1  R-EU_R0805  [R0805]
R70  47R  R-EU_R0805  [R0805]
R71  1K  R-EU_R0805  [R0805]
R72  100R  R-EU_R0805  [R0805]
R73  1K1  R-EU_R0805  [R0805]
R74  47R  R-EU_R0805  [R0805]
R75  1K  R-EU_R0805  [R0805]
R76  100R  R-EU_R0805  [R0805]
R77  1K1  R-EU_R0805  [R0805]
R78  47R  R-EU_R0805  [R0805]
R79  1K  R-EU_R0805  [R0805]
R80  560K  R-EU_R1206  [R1206]
R81  560K  R-EU_R1206  [R1206]
R82  100R  R-EU_R0805  [R0805]
R83  1K1  R-EU_R0805  [R0805]
SH5  SHORTNOHOLE  [SHORT_NOHOLE]
SH6  SHORTNOHOLE  [SHORT_NOHOLE]
SH7  SHORTNOHOLE  [SHORT_NOHOLE]
SH8  SHORTNOHOLE  [SHORT_NOHOLE]
TVS5  PESD12VL1BA,115  PESDXL1BA  [SOD323-BIDIR]
TVS6  PESD12VL1BA,115  PESDXL1BA  [SOD323-BIDIR]
TVS7  PESD12VL1BA,115  PESDXL1BA  [SOD323-BIDIR]
TVS8  PESD12VL1BA,115  PESDXL1BA  [SOD323-BIDIR]

### Nets
1V25_REF: JP3.NO ; also sheet 4
!ADC_CS: IC36.38(!CS) ; also sheet 2
!RESET: IC36.2(!RST/!PD) ; also sheet 1,2,4
+3V3_ISO: C95.2 IC36.34(DVDD) ; also sheet 1,2,3,4,5
+5V_ISO: FB8.P$1 ; also sheet 1,4
+15V_ISO: C86.1 IC21.5(A:V+) IC22.5(A:V+) IC23.5(A:V+) IC24.5(A:V+) IC25.5(A:V+) IC26.5(A:V+) IC27.5(A:V+) IC28.5(A:V+) IC29.5(A:V+) IC30.5(A:V+) IC31.5(A:V+) IC32.5(A:V+) IC33.5(A:V+) IC34.5(A:V+) ; also sheet 1
-12V_ISO: R64.1 R65.1 R66.1 R67.1 ; also sheet 1,3,4
-15V_ISO: C87.1 IC21.2(A:V-) IC22.2(A:V-) IC23.2(A:V-) IC24.2(A:V-) IC25.2(A:V-) IC26.2(A:V-) IC27.2(A:V-) IC28.2(A:V-) IC29.2(A:V-) IC30.2(A:V-) IC31.2(A:V-) IC32.2(A:V-) IC33.2(A:V-) IC34.2(A:V-) ; also sheet 1
ADC_AVDD: C88.1 C94.2 FB8.P$2 IC35.5(P:V+) IC36.9(AVDD) IC36.30(AVDD)
ADC_IRQ: IC36.35(ALARM) ; also sheet 2
ADC_MISO: IC36.36(SDO) ; also sheet 2
ADC_MOSI: IC36.1(SDI) ; also sheet 2
ADC_SCLK: IC36.37(SCLK) ; also sheet 2
ADC_VREF: C91.2 IC35.3(A:+IN) IC36.5(REFIO)
AGND2: R72.1 R73.1 SH6.2(GND_B) TVS6.C1
AGND4: R82.1 R83.1 SH8.2(GND_B) TVS8.C1
AIN0: FB5.P$2 Q6.3(D) R60.2 TVS5.C2
AIN1: FB6.P$2 Q8.3(D) R61.2 TVS6.C2
AIN_0GND: C89.1 IC36.17(AIN_0GND) R69.2
AIN_0P: C89.2 IC36.16(AIN_0P) R63.2 R66.2
AIN_1GND: C90.1 IC36.19(AIN_1GND) R73.2
AIN_1P: C90.2 IC36.18(AIN_1P) R64.2 R71.2
AIN_2GND: C96.1 IC36.20(AIN_2GND) R77.2
AIN_2P: C96.2 IC36.21(AIN_2P) R67.2 R75.2
AIN_3GND: C97.1 IC36.22(AIN_3GND) R83.2
AIN_3P: C97.2 IC36.23(AIN_3P) R65.2 R79.2
CURR_SW0: IC22.3(A:IN) IC27.3(A:IN) ; also sheet 2
CURR_SW1: IC23.3(A:IN) IC28.3(A:IN) ; also sheet 2
CURR_SW2: IC24.3(A:IN) IC29.3(A:IN) ; also sheet 2
CURR_SW3: IC25.3(A:IN) IC30.3(A:IN) ; also sheet 2
GND: C86.2 C87.2 C88.2 C91.1 C92.1 C93.1 C94.1 C95.1 C98.2 IC21.4(A:GND) IC22.4(A:GND) IC23.4(A:GND) IC24.4(A:GND) IC25.4(A:GND) IC26.4(A:GND) IC27.4(A:GND) IC28.4(A:GND) IC29.4(A:GND) IC30.4(A:GND) IC31.4(A:GND) IC32.4(A:GND) IC33.4(A:GND) IC34.4(A:GND) IC35.2(P:V-) IC36.3(DAISY) IC36.4(!REFSEL) IC36.6(REFGND) IC36.8(AGND) IC36.11(AUX_GND) IC36.28(AGND) IC36.29(AGND) IC36.31(AGND) IC36.32(AGND) IC36.33(DGND) R81.2 SH5.1(GND_A) SH6.1(GND_A) SH7.1(GND_A) SH8.1(GND_A) X4.2 X4.4 X4.6 X4.8 ; also sheet 1,2,3,4,5
N$2: Q12.1(G) Q13.2(S) R78.1
N$3: R68.1 R69.1 SH5.2(GND_B) TVS5.C1
N$4: Q12.2(S) Q13.1(G) R78.2
N$6: IC25.1(B:NO) IC30.6(B:COM) R82.2
N$20: IC21.6(B:COM) IC26.6(B:COM) JP3.COM
N$21: R80.2 R81.1
N$28: IC25.6(B:COM) IC34.6(B:COM) JP5.2 R79.1
N$30: IC30.1(B:NO) IC34.1(B:NO) Q13.3(D)
N$31: IC35.1(A:OUT) IC35.4(A:-IN) JP3.NC
N$32: Q8.1(G) Q9.2(S) R70.1
N$33: Q8.2(S) Q9.1(G) R70.2
N$35: C92.2 C93.2 IC36.7(REFCAP)
N$50: IC23.1(B:NO) IC28.6(B:COM) R72.2
N$51: IC23.6(B:COM) IC32.6(B:COM) R71.1
N$75: IC28.1(B:NO) IC32.1(B:NO) Q9.3(D)
N$77: Q10.1(G) Q11.2(S) R74.1
N$78: Q6.1(G) Q7.2(S) R62.1
N$84: Q10.2(S) Q11.1(G) R74.2
N$85: IC24.1(B:NO) IC29.6(B:COM) R76.2
N$86: Q6.2(S) Q7.1(G) R62.2
N$87: IC24.6(B:COM) IC33.6(B:COM) JP4.2 R75.1
N$88: IC29.1(B:NO) IC33.1(B:NO) Q11.3(D)
N$89: IC22.1(B:NO) IC27.6(B:COM) R68.2
N$90: R76.1 R77.1 SH7.2(GND_B) TVS7.C1
N$91: FB5.P$1 X4.1
N$92: IC22.6(B:COM) IC31.6(B:COM) R63.1
N$93: FB6.P$1 X4.3
N$94: FB7.P$1 X4.5
N$95: IC27.1(B:NO) IC31.1(B:NO) Q7.3(D)
N$96: FB9.P$1 X4.7
N$126: IC21.1(B:NO) R60.1
N$130: IC26.1(B:NO) R61.1
N$136: FB7.P$2 JP4.1 Q10.3(D) TVS7.C2
N$137: FB9.P$2 JP5.1 Q12.3(D) TVS8.C2
PE: C98.1 R80.1 ; also sheet 1
TEMP_SW#1: IC21.3(A:IN) ; also sheet 2
TEMP_SW#2: IC26.3(A:IN) ; also sheet 2
VOLT_SW0: IC31.3(A:IN) ; also sheet 2
VOLT_SW1: IC32.3(A:IN) ; also sheet 2
VOLT_SW2: IC33.3(A:IN) ; also sheet 2
VOLT_SW3: IC34.3(A:IN) ; also sheet 2
Unconnected: IC36.10(AUX_IN)

### Buses
CURR_SW[0..3]
VOLT_SW[0..3]

### Notes on the sheet
- C0G
- C0G
- C0G
- Analog voltage/current inputs
  Cold junction compensation
- C0G
- Licensed under the TAPR Open Hardware License (www.tapr.org/OHL)
- More info at http://www.envox.hr/eez
- Repository: https://github.com/eez-open

## Library data of the parts
C1-C24 C26-C98 = rcl:C-EU: CAPACITOR, European symbol
C25 = EEZ_Lib1:ECAP
D1-D14 = diode:BAT54S: Schottky Diodes Pin connection corrected 2011-05-04 Source: Fairchild .. BAT54.pdf
FB1-FB9 = EEZ_Lib1:FERRITE_BEAD: FAIR-RITE - 2506033007Y3 - FERRITE BEAD, 0.04OHM, 3A, 0603 Farnell: 2112873
FM1 FM2 = EEZ_Lib1:FIDUCIAL: Fiducial mark for pick and place automation
IC1 = EEZ_Lib1:AT24CXX: I2C-Compatible (2-wire) Serial EEPROM
IC2 IC3 = EEZ_Lib1:SI8641: Low power 4-ch digital isolator (3+1) Farnell: 2423288
IC4 = EEZ_Lib1:MC78LXX: μA78L00 series positive voltage regulators
IC5 IC6 = EEZ_DIB:LP2985: 150-mA Low-noise Low-dropout Regulator With Shutdown
IC7 = EEZ_Lib1:MC79LXX: 3-terminal negative voltage regulator, up to 100mA
IC8 = EEZ_DIB:STM32F446
IC9 IC14 = EEZ_Lib1:TL072
IC10 IC11 = EEZ_TI:DAC7760: Single-Channel, 12-Bit Programmable Current and Voltage Output DAC for 4-mA to 20-mA Current Loop Applications
IC12 IC35 = EEZ_TI:OPA376A: Low-Noise, Low Quiescent Current, Precision Operational Amplifier
IC13 = EEZ_TI:DAC7563: Dual 12-Bit, Low-Power, Buffered, Voltage-Output DAC With 2.5-V, 4-PPM/°C Internal Reference
IC15-IC18 = EEZ_Lib1:BTS3408G: Smart Dual Low-side Power Switch
IC19 = EEZ_DIB:74HC126: Quad buffer/line driver; 3-state
IC20 = EEZ_Lib1:TL431: Precision programmable reference
IC21-IC34 = EEZ_DIB:DG468: Low Power, High Voltage SPST Analog Switch
IC36 = EEZ_TI:ADS8674: 14-Bit, 500-kSPS, 4-Channel, Single-Supply, SAR ADCs with Bipolar Input Ranges
J1 = EEZ_connectors:PCB_TAB: PCB quick-fit terminal
J2 = EEZ_Lib1:5033981892: SD Micro connector; push-push; SMT; gold plated
JP1 JP2 JP4 JP5 = EEZ_Lib1:JP2-CUT
JP3 = EEZ_Lib1:JP3-CUT
KK1 KK2 = EEZ_Lib1:PCB-MB: Richo Mounting Block; 16 x 6 mm
L1-L3 = EEZ_inductors_and_transformers:DLW21S: Murata 0805 Common mode choke coil/Common mode noise filter
Q1-Q5 = EEZ_DIB:2N7002PS: Dual 60 V, 320 mA N-channel Trench MOSFET
Q6-Q13 = EEZ_Lib1:BSS169: SIPMOS® Small-Signal-Transistor depletion mode
R1-R83 = rcl:R-EU_: RESISTOR, European symbol
RN1-RN5 = EEZ_Lib1:R_ARRAY4: 1206 four resistor array
SH1-SH8 = EEZ_Lib1:SHORT
TR1 = EEZ_inductors_and_transformers:TBA-DUAL: Traco 1W and 2W DC/DC converter dual output
TR2 = EEZ_inductors_and_transformers:MDD02: Mean Well 2W SIP Package DC-DC Medical Grade Unregulated Converter
TVS1-TVS8 = EEZ_Lib1:PESDXL1BA: Low capacitance bidirectional ESD protection diodes
X1 = EEZ_connectors:77317-104-28LF: Headers & Wire Housings 28P right angle 0.1" pitch
X2 = con-samtec:SSW-106-02-S-S: THROUGH-HOLE .025" SQ POST SOCKET Source: Samtec SSW.pdf; MPN: SSW-106-02-S-S; OC_FARNELL: unknown; OC_NEWARK: 11P9416
X3 X4 = EEZ_connectors:691327310016: WR-TBL Serie 3273 – 3.81mm Close Horizontal Dual Row PCB Header, 16 Pins
Y1 = EEZ_Lib1:XTAL

## Net classes
0 default: width 0.203 mm, drill 0.3 mm, clearance 0.203 mm
1 lvds: width 0.152 mm, drill 0.3 mm, clearance 0.152 mm to class 0, clearance 0.152 mm
2 gnd: width 0.254 mm, drill 0.584 mm, clearance 0.254 mm
3 diff_in: width 0.254 mm, drill 0.584 mm, clearance 0.203 mm to class 0, clearance 0.203 mm to class 1, clearance 0.203 mm to class 2, clearance 0.203 mm